# EAGLE design dasblinkenhat-controller-mk-4.0 (EAGLE 7.5.0)
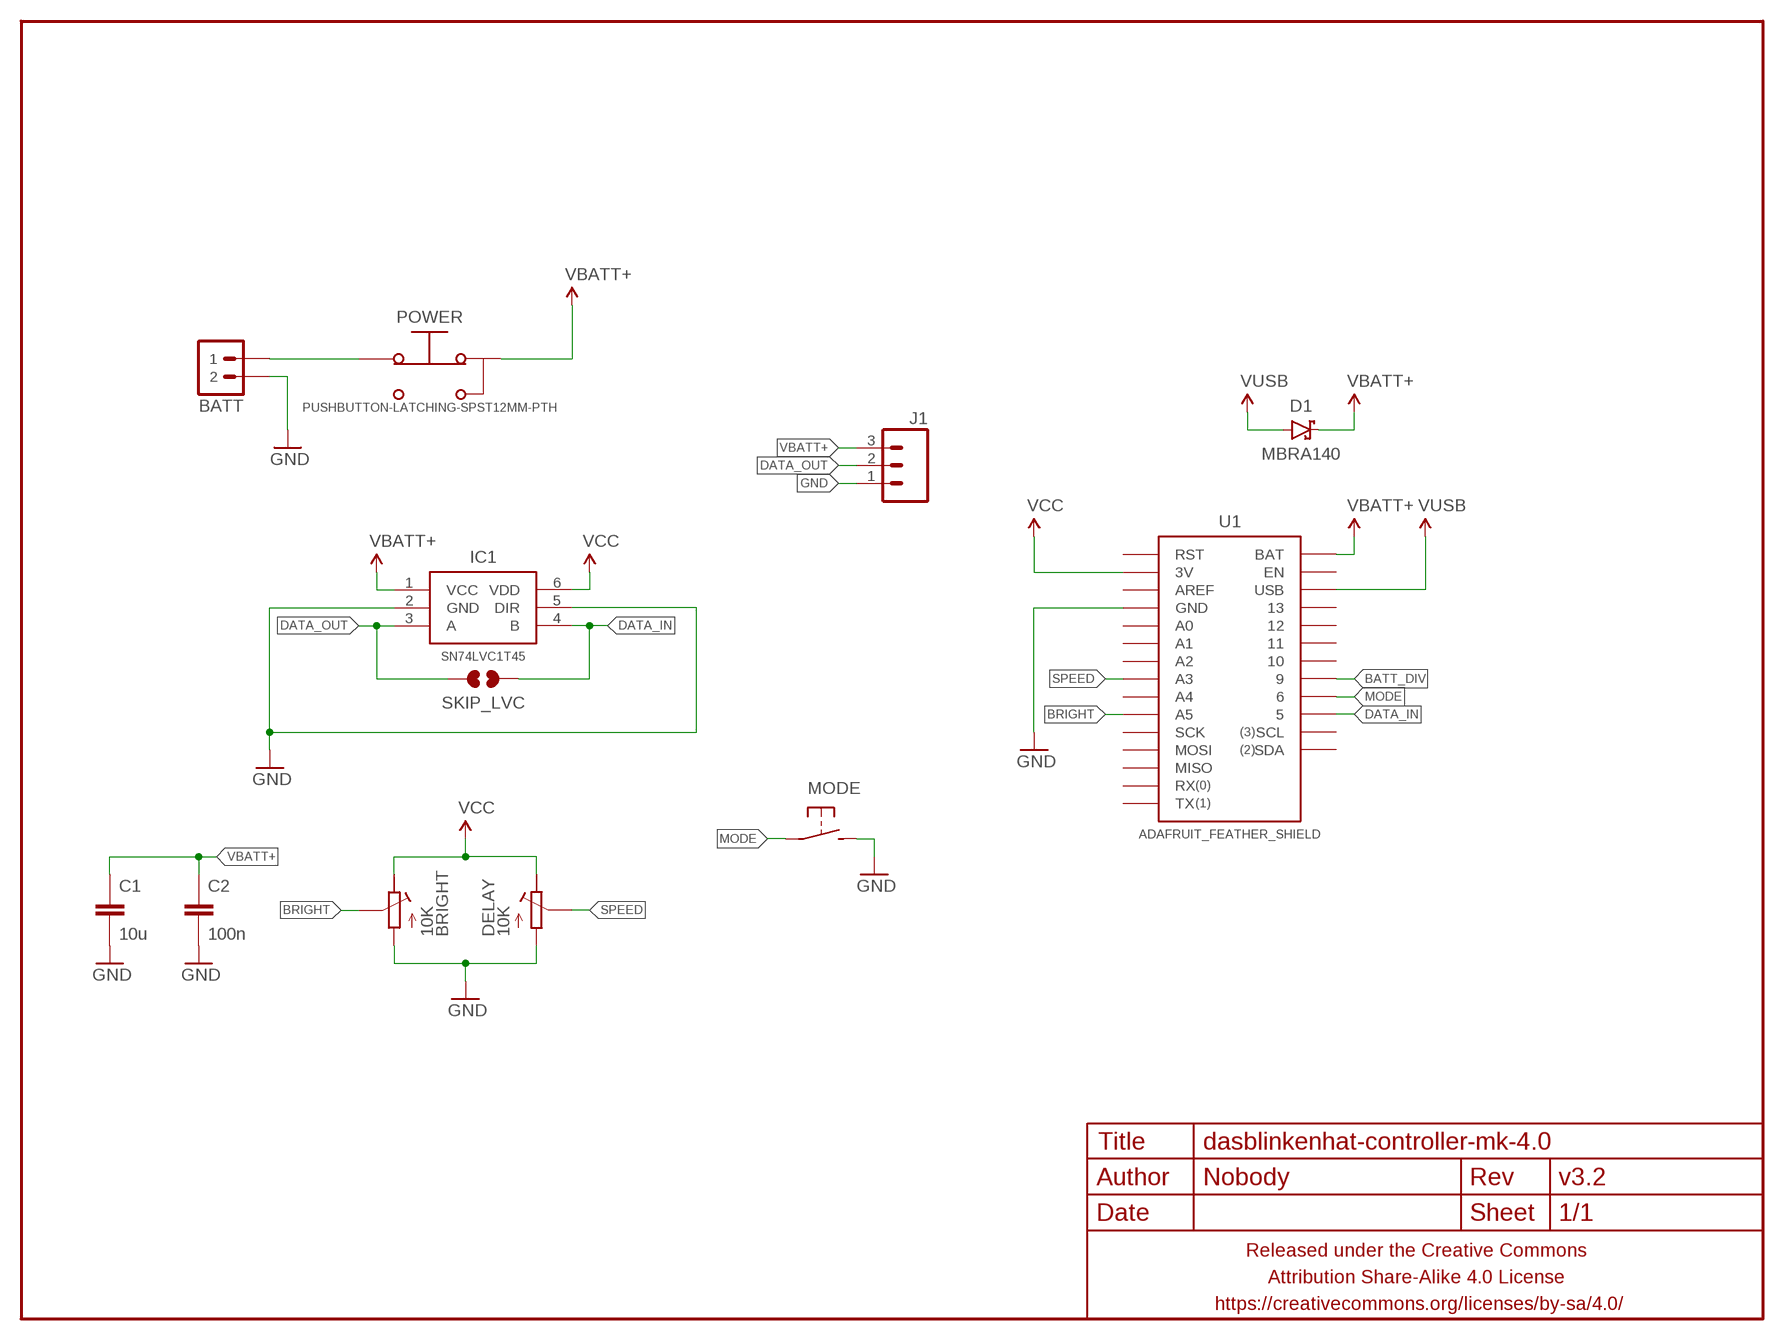
[diagram p0: schematic, sheet 1]

## Parts
BATT  M02JST-2MM-SMT  [JST-2-SMD]
BRIGHT  10K  POTENTIOMETEREVM3Y  [EVM3Y]
C1  10u  CAPACITOR-CERAMICC0805  [C0805]
C2  100n  CAPACITOR-CERAMICC0805  [C0805]
D1  MBRA140  DIODE-SCHOTTKYSMA  [SMA-DIODE-SCHOTTKY]
DELAY  10K  POTENTIOMETEREVM3Y  [EVM3Y]
FRAME1  FRAME-LETTERNO_PACKAGE  [DUMMY]
IC1  SN74LVC1T45  SN74LVC1T45SOT23-6  [SOT23-6]
J1  M03JST-XH-RA-PTH  [JST-3-XH-RA-PTH]
MODE  DTS-6MM  SPST-NO-TACT6MM-SMD  [DTSM-6]
POWER  PUSHBUTTON-LATCHING-SPST12MM-PTH  [PUSHBUTTON-CW-SPST-12MM]
SKIP_LVC  JUMPER-PAD-2-NOYES_SILK  [PAD-JUMPER-2-NO_YES_SILK]
U1  ADAFRUIT_FEATHER_SHIELD  [ADAFRUIT_FEATHER]

## Nets
BATT_DIV: U1.9
BRIGHT: BRIGHT.S U1.A5
DATA_IN: IC1.4(B) SKIP_LVC.1 U1.5
DATA_OUT: IC1.3(A) J1.2 SKIP_LVC.2
GND: BATT.1 BRIGHT.A C1.2 C2.2 DELAY.A IC1.2(GND) IC1.5(DIR) J1.1 MODE.3 MODE.4 U1.GND@0(GND) U1.GND@1(GND)
MODE: MODE.1 MODE.2 U1.6
N$1: BATT.2 POWER.2(NC)
SPEED: DELAY.S U1.A3
VBATT+: C1.1 C2.1 D1.C IC1.1(VCC) J1.3 POWER.1(COM) U1.BAT
VCC: BRIGHT.E DELAY.E IC1.6(VDD) U1.3V
VUSB: D1.A U1.USB
Unconnected: U1.10 U1.11 U1.12 U1.13 U1.A0 U1.A1 U1.A2 U1.A4 U1.AREF U1.EN U1.MISO U1.MOSI U1.RST U1.RX U1.SCK U1.SCL U1.SDA U1.TX

## Library data of the parts
BATT = a_parts:M02: Standard 2-pin 0.1" header. Use with - straight break away headers ( PRT-00116) - right angle break away headers (PRT-00553) - swiss pins (PRT-00743) - machine pins (PRT-00117) - female headers (PRT-00115) Molex polarized connector foot print use with: PRT-08233 with associated crimp pins and housings. 2.54_SCREWTERM for use with PRT-10571. 3.5mm Screw Terminal footprints for PRT-08084 5mm Screw Terminal footprints for use with PRT-08433; PROD_ID: CONN-08352
BRIGHT DELAY = a_parts:POTENTIOMETER: Trimm resistor
C1 C2 = a_parts:CAPACITOR-CERAMIC: CAPACITOR, European symbol
D1 = a_parts:DIODE-SCHOTTKY: Schottky diodes in SFE's production catalog BAT20J 1A 23V 0.62Vf RB751 120mA 40V 0.37Vf PMEG4005EJ 0.5A 40V 0.42Vf MBRA140 1A 40V 0.5Vf B340A 3A 40V SMA
FRAME1 = a_parts:FRAME-LETTER: Schematic Frame Standard 8.5x11 US Letter frame; DESIGNER: Nobody; VERSION: v3.2
IC1 = a_parts:SN74LVC1T45
J1 = a_parts:M03: Header 3 Standard 3-pin 0.1" header. Use with straight break away headers (SKU : PRT-00116), right angle break away headers (PRT-00553), swiss pins (PRT-00743), machine pins (PRT-00117), and female headers (PRT-00115). Molex polarized connector foot print use with SKU : PRT-08232 with associated crimp pins and housings.
MODE = A_butts:SPST-NO-TACT
POWER = a_parts:PUSHBUTTON-LATCHING-SPST
SKIP_LVC = a_parts:JUMPER-PAD-2-NO
U1 = a_parts:ADAFRUIT_FEATHER_SHIELD

## Board
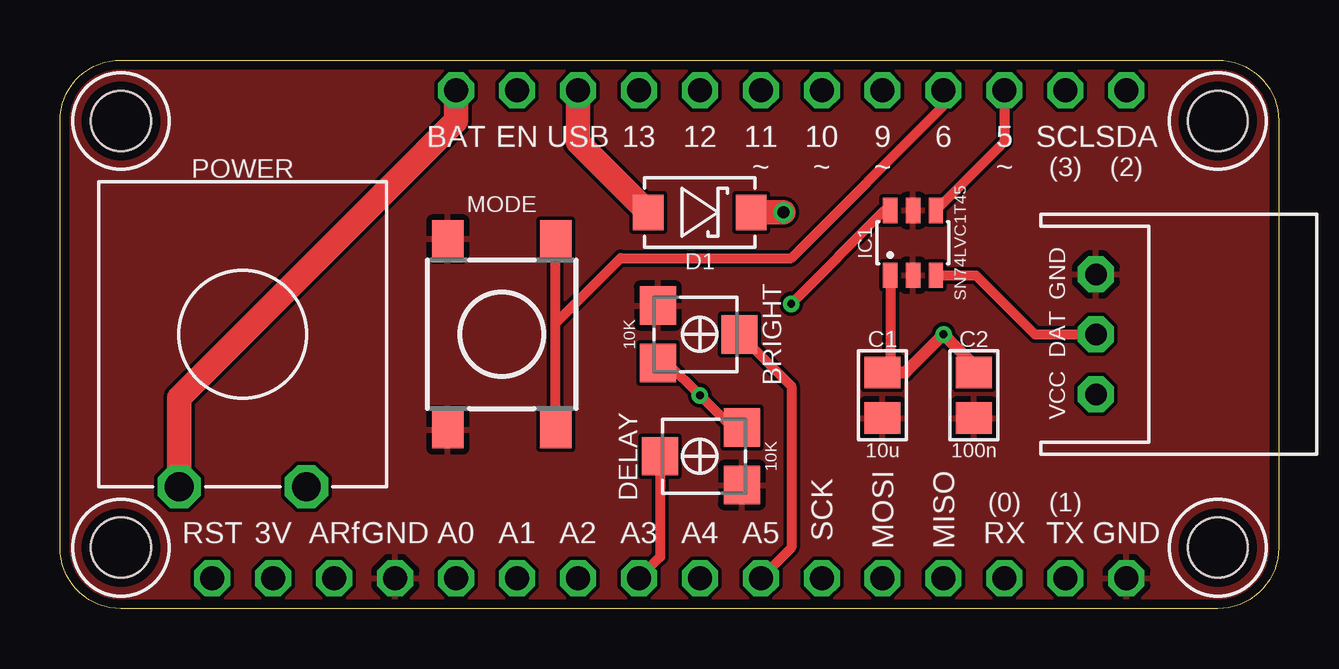
[diagram p1: board, top side]
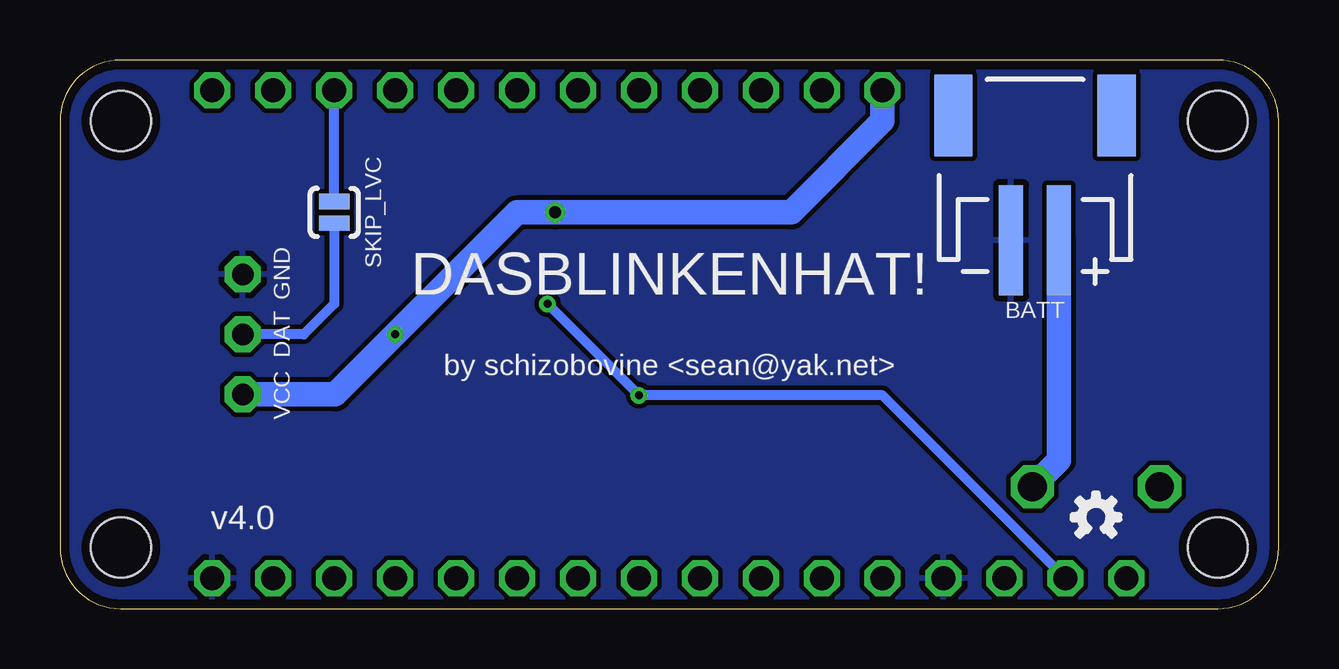
[diagram p2: board, bottom side, seen from below]

Size 50.8 x 22.86 mm. Coordinates in mm from the lower left corner, seen from the top.
Outline: 48.26,0 2.54,0 arc-90 0,2.54 0,20.32 arc-90 2.54,22.86 48.26,22.86 arc-90 50.8,20.32 50.8,2.54 arc-90 48.26,0
Copper layers (1*16): Top 0.0356mm / dielectric 1.5011mm / Bottom 0.0356mm
Design rules "LaenPCBOrder2": minimum track width 6mil, minimum drill 13mil, track to track 6mil, track to pad 6mil, pad to pad 6mil, via to via 6mil, smd to smd 6mil, copper to edge 15mil, drill to drill 6mil, minimum pad ring 7mil, minimum via ring 7mil, stop-mask expansion 3mil, vias tented up to drill 20mil, thermal gap 10mil
Holes 2.5 mm at 2.54,20.32 2.54,2.54 48.26,2.54 48.26,20.32

### Footprints (pad centres in the part's own frame; a part is rotated, then mirrored left to right if it is on the bottom)
JST-2-SMD = smd 1 x 4.6: 1 -1,-3.7; 2 1,-3.7 | smd 1.6 x 3.4: NC1 -3.4,1.5; NC2 3.4,1.5
EVM3Y = smd 1.6 x 1.5: A -1.2,-1.75; E 1.2,-1.75; S 0,1.65
C0805 = smd 1.3 x 1.5: 1 -0.95,0; 2 0.95,0
SMA-DIODE-SCHOTTKY = smd 1.27 x 1.47: A -2.15,0; C 2.15,0
SOT23-6 = smd 0.6 x 1.05: 1 -0.95,-1.35; 2 0,-1.35; 3 0.95,-1.35; 4 0.95,1.35; 5 0,1.35; 6 -0.95,1.35
JST-3-XH-RA-PTH = drill 0.9 pad 1.5 octagon: 1 -2.5,0; 2 0,0; 3 2.5,0
DTSM-6 = smd 1.55 x 1.3: 1 -3.975,2.25; 2 3.975,2.25; 3 -3.975,-2.25; 4 3.975,-2.25
PUSHBUTTON-CW-SPST-12MM = drill 1.2 octagon: 1 6.35,-2.65; 2 6.35,2.65
PAD-JUMPER-2-NO_YES_SILK = smd 0.635 x 1.27: 1 -0.45,0; 2 0.45,0
ADAFRUIT_FEATHER = drill 1 pad 1.5 octagon: 3V -16.51,-10.16; 5 13.97,10.16; 6 11.43,10.16; 9 8.89,10.16; 10 6.35,10.16; 11 3.81,10.16; 12 1.27,10.16; 13 -1.27,10.16; A0 -8.89,-10.16; A1 -6.35,-10.16; A2 -3.81,-10.16; A3 -1.27,-10.16; A4 1.27,-10.16; A5 3.81,-10.16; AREF -13.97,-10.16; BAT -8.89,10.16; EN -6.35,10.16; GND@0 -11.43,-10.16; GND@1 19.05,-10.16; MISO 11.43,-10.16; MOSI 8.89,-10.16; RST -19.05,-10.16; RX 13.97,-10.16; SCK 6.35,-10.16; SCL 16.51,10.16; SDA 19.05,10.16; TX 16.51,-10.16; USB -3.81,10.16

### Placement (x,y rotation side)
BATT  10.16,19.05 0 bottom
BRIGHT  26.67,11.43 270 top
C1  34.29,8.89 270 top
C2  38.1,8.89 270 top
D1  26.67,16.51 0 top
DELAY  26.67,6.35 90 top
FRAME1  0,0 0 top
IC1  35.56,15.24 0 top
J1  43.18,11.43 270 top
MODE  18.41,11.43 270 top
POWER  7.62,11.43 270 top
SKIP_LVC  39.37,16.51 270 bottom
U1  25.4,11.43 0 top
U$2  [OSHWLOGO_TINY_SILKONLY]  7.62,3.81 0 bottom

### Tracks (layer width: path | path; a pad name or v marks a point on that pad's centre or on a via)
BRIGHT
  Top 0.406: BRIGHT.S 30.48,9.27 30.48,2.54 U1.A5
DATA_IN
  Top 0.406: U1.5 39.37,19.45 IC1.4
  Bottom 0.406: SKIP_LVC.1 U1.5
DATA_OUT
  Top 0.406: IC1.3 38.18,13.89 40.64,11.43 J1.2
  Bottom 0.406: SKIP_LVC.2 39.37,12.7 40.64,11.43 J1.2
GND
  pour Top: 48.26,0 2.54,0 arc-90 0,2.54 0,20.32 arc-90 2.54,22.86 48.26,22.86 arc-90 50.8,20.32 50.8,2.54 arc-90
  pour Bottom (isolate 0.2): 48.26,0 2.54,0 arc-90 0,2.54 0,20.32 arc-90 2.54,22.86 48.26,22.86 arc-90 50.8,20.32 50.8,2.54 arc-90
MODE
  Top 0.406: MODE.2 20.66,11.9 | 20.66,11.9 MODE.1 | 20.66,11.9 23.37,14.61 30.48,14.61 36.83,20.95 U1.6
N$1
  Bottom 1.016: BATT.2 9.16,6.19 POWER.2
SPEED
  Top 0.406: DELAY.S 25.02,2.16 U1.A3
VBATT+  (via drill 0.33, 0.5)
  Top 0.406: IC1.1 34.61,10.16 C1.1
  Top 0.508: C1.1 35.24,9.84 v36.83,11.43 38.1,10.16 C2.1
  Top 1.016: POWER.1 4.97,8.78 16.51,20.32 U1.BAT | v30.16,16.51 D1.C
  Bottom 1.016: U1.BAT 16.51,20.32 20.32,16.51 v30.16,16.51 31.75,16.51 v36.83,11.43 39.33,8.93 J1.3
VCC  (via drill 0.33)
  Top 0.406: DELAY.E 28.01,7.55 v26.67,8.89 25.33,10.23 BRIGHT.E | v30.48,12.7 34.37,16.59 IC1.6
  Bottom 0.406: U1.3V 16.51,8.89 v26.67,8.89 v30.48,12.7
VUSB
  Top 1.016: U1.USB 21.59,19.44 D1.A

### Text on the board
tPlace: GND | DAT | VCC
bPlace: GND | DAT | VCC